# Altium project LoraWIO_module.PrjPcb
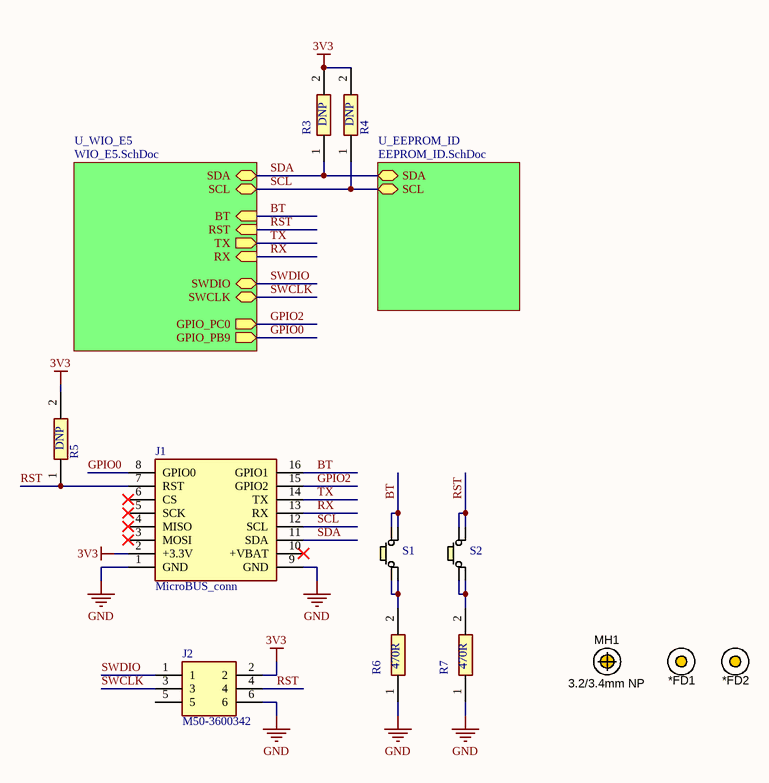
[diagram p0: main.SchDoc]
Author: Evžen Šteif; Revision: 1.0
3 sheets, 24 parts. Net scope: hierarchical (ports join the sheet entries above them; power ports are global).
Board file: LoraWio_module.PcbDoc
Sheets:
  main.SchDoc
    U_WIO_E5 = WIO_E5.SchDoc
    U_EEPROM_ID = EEPROM_ID.SchDoc

## Sheet main.SchDoc
size A4; SheetNumber: 1; SheetTotal: 3

### Parts
*FD1  FIDUCIAL  [FIDUCIAL]  (value not drawn)
*FD2  FIDUCIAL  [FIDUCIAL]  (value not drawn)
J1  MicroBUS_conn  [MicroBUS_header]
J2  M50-3600342  [HUSSP6W42P127_2X3_381X340X440P]
MH1  3.2/3.4mm NP  [TH_MH3.2/3.4NP]  (no BOM)
R3  DNP  [RESC1005X35N]
R4  DNP  [RESC1005X35N]
R5  DNP  [RESC1005X35N]
R6  470R  [RESC1005X40N]
R7  470R  [RESC1005X40N]
S1  KMR731NG_LFS  [KMR731NGLFS]  (value not drawn)
S2  KMR731NG_LFS  [KMR731NGLFS]  (value not drawn)

### Sub-sheets
U_EEPROM_ID = EEPROM_ID.SchDoc: SDA (bidir), SCL (bidir)
U_WIO_E5 = WIO_E5.SchDoc: SWDIO (bidir), SWCLK (bidir), RST (in), TX (out), RX (in), SCL (bidir), SDA (bidir), BT (in), GPIO_PC0 (out), GPIO_PB9 (out)

### Nets
3V3: J1.2(+3.3V) J2.2 R3.2 R4.2 R5.2
GND: J1.1(GND) J1.9(GND) J2.6 R6.1 R7.1
BT: J1.16(GPIO1) S1.3 S1.4 ; sheet U_WIO_E5/BT
GPIO0: J1.8(GPIO0) ; sheet U_WIO_E5/GPIO_PB9
GPIO2: J1.15(GPIO2) ; sheet U_WIO_E5/GPIO_PC0
RST: J1.7(RST) J2.4 R5.1 S2.3 S2.4 ; sheet U_WIO_E5/RST
RX: J1.13(RX) ; sheet U_WIO_E5/RX
SCL: J1.12(SCL) R4.1 ; sheet U_WIO_E5/SCL, sheet U_EEPROM_ID/SCL
SDA: J1.11(SDA) R3.1 ; sheet U_WIO_E5/SDA, sheet U_EEPROM_ID/SDA
SWCLK: J2.3 ; sheet U_WIO_E5/SWCLK
SWDIO: J2.1 ; sheet U_WIO_E5/SWDIO
TX: J1.14(TX) ; sheet U_WIO_E5/TX
NetR6_2: R6.2 S1.1 S1.2
NetR7_2: R7.2 S2.1 S2.2

Not connected (* = marked no-connect by the designer): *FD1 1; *FD2 1; J1 3(MOSI)* 4(MISO)* 5(SCK)* 6(CS)* 10(+VBAT)*; J2 5

### Notes on the sheet
- Title:
- Date:
- Project:
- Type:
- Schematic
- Variant:
- Revision:
- Sheet
- of
- Author:
- Evžen Šteif
- Size:
- A4

### Library data of the parts
*FD1 *FD2 = MCH_00028: Autor: Lukas Krahulec; Jablotron_Price: 0; Location: LE; Active: 1; Temperature_Min: -55; Temperature_Max: 125; TemperatureRange: Military; Sourcing: None; Generic_replacement: No; LatestRevisionDate: 25.6.2018; Value: Fiducial; PartNumber: MCH_00028; LE_Price: 0; Technology: NOP; Designer: Lukas Krahulec; Librarian: Lukas Krahulec; Manufacturer: LE; FIT: 0; ComponentLink1URL: http://www.logicelements.cz; ComponentLink1Description: Manufacturer Web; Cat1: Fiducial; ROHS: 1; Storage_Count: 0
J1 = MicroBUS_conn: Connector; Manufacturer_Name: Harwin; Manufacturer_Part_Number: M20-9730845; Datasheet Link: https://cdn.harwin.com/pdfs/M20-973.pdf; Height: 9.54mm; Mouser Part Number: 855-M20-9730845; Mouser Price/Stock: https://www.mouser.co.uk/ProductDetail/Harwin/M20-9730845?qs=%252Bk6%2F5FB6qrnRfgIEPS4Dkw%3D%3D
J2 = M50-3600342: Connector; Manufacturer_Name: Harwin; Datasheet Link: https://cdn.harwin.com/pdfs/M50-360.pdf; Manufacturer_Part_Number: M50-3600342; Mouser Part Number: 855-M50-3600342; Mouser Price/Stock: https://www.mouser.co.uk/ProductDetail/Harwin/M50-3600342?qs=uLfVlVfCHH3O1msIjvLxbQ%3D%3D
MH1 = MCH_00037: (Mount Hole 3.2mm); Autor: Lukas Krahulec; Jablotron_Price: 0; Location: LE; Active: 1; Temperature_Min: -55; Temperature_Max: 125; TemperatureRange: Military; Cat1: Mounting Holes; Cat2: Non-Plated; Sourcing: None; Generic_replacement: No; LatestRevisionDate: 24.2.2020; Value: 3.2/3.4mm NP; PartNumber: MCH_00037; LE_Price: 0; Technology: NOP; Designer: Lukas Krahulec; Librarian: Lukas Krahulec; Manufacturer: LE; FIT: 0; ComponentLink1URL: http://www.logicelements.cz; ComponentLink1Description: Manufacturer Web; Cat3: 3.2 mm; ROHS: 1; Storage_Count: 0
R3-R5 = RT0402FRE075K1L: Resistor; Manufacturer_Name: YAGEO; Datasheet Link: https://www.yageo.com/upload/media/product/app/datasheet/rchip/pyu-rt_1-to-0.01_rohs_l.pdf; Height: 0.35mm; Manufacturer_Part_Number: RT0402FRE075K1L; Mouser Part Number: RT0402FRE075K1L; Mouser Price/Stock: https://www.mouser.co.uk/ProductDetail/YAGEO/RT0402FRE07100RL?qs=BXCcY9r%252B08AcvLZjF7vcwQ%3D%3D
R6 R7 = RC0402JR-07470RL: Resistor; Manufacturer_Name: KEMET; Datasheet Link: http://www.yageo.com/documents/recent/PYu-RC0402_51_RoHS_L_6_r.pdf; Height: 0.4mm; Manufacturer_Part_Number: RC0402JR-07470RL; Mouser Part Number: 603-RC0402JR-07470RL; Mouser Price/Stock: https://www.mouser.co.uk/ProductDetail/Yageo/RC0402JR-07470RL/?qs=uM1JSSdPjOBB2HN7BZcUiA%3D%3D; Arrow Part Number: RC0402JR-07470RL; Arrow Price/Stock: https://www.arrow.com/en/products/rc0402jr-07470rl/yageo
S1 S2 = KMR731NG_LFS: Switch; Manufacturer_Name: C & K COMPONENTS; Manufacturer_Part_Number: KMR731NG LFS; Datasheet Link: https://www.ckswitches.com/media/1908/kmr7.pdf; Mouser Part Number: 611-KMR731NGLFS; Mouser Price/Stock: https://www.mouser.com/Search/Refine.aspx?Keyword=611-KMR731NGLFS; Arrow Part Number: KMR731NG LFS; Arrow Price/Stock: https://www.arrow.com/en/products/kmr731nglfs/ck

## Sheet WIO_E5.SchDoc
size A4; SheetNumber: 2; SheetTotal: 3
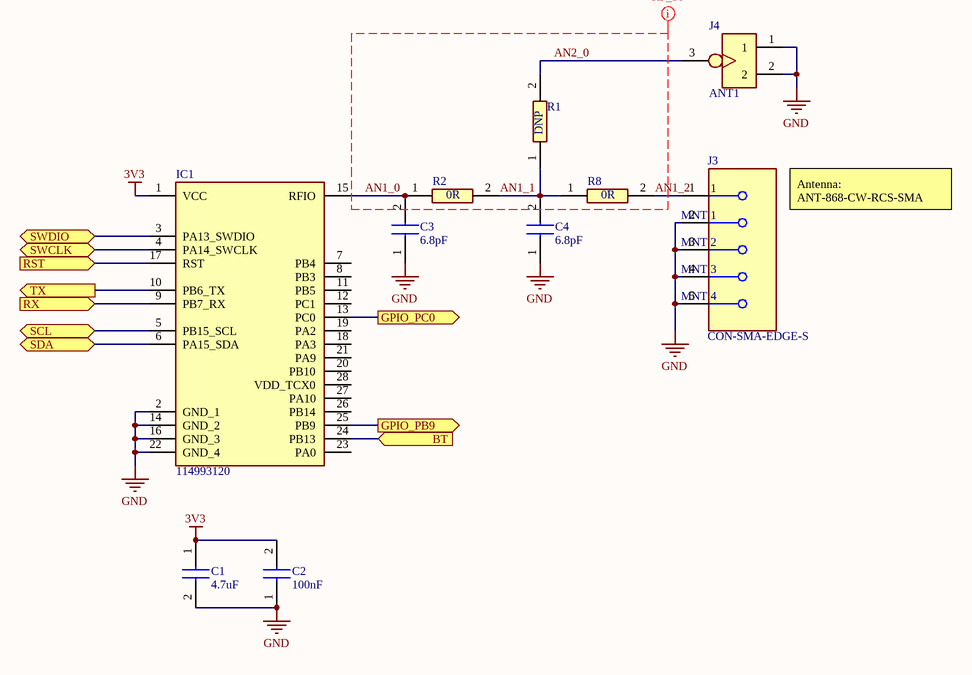
[diagram p1: WIO_E5.SchDoc]

### Parts
C1  4.7uF  [CAPC1608X90N]
C2  100nF  [CAPC1005X70N]
C3  6.8pF  [GCM155]
C4  6.8pF  [GCM155]
IC1  114993120  [114993120]
J3  CON-SMA-EDGE-S  [FP-CON-SMA-EDGE-S-MFG]
J4  ANT1  [RECE.20279.001E.01]
R1  DNP  [RESC1005X40N]
R2  0R  [RESC1005X40N]
R8  0R  [RESC1005X40N]

### Ports
BT (in, see main[2B]), GPIO_PB9 (out, see main[2B]), GPIO_PC0 (out, see main[2B]), RST (in, see main[2B]), RX (in, see main[2B]), SCL (bidir, see main[2B], EEPROM_ID[3B]), SDA (bidir, see main[2B], EEPROM_ID[3B]), SWCLK (bidir, see main[2B]), SWDIO (bidir, see main[2B]), TX (out, see main[2B])

### Nets
3V3: C1.1 C2.2 IC1.1(VCC)
GND: C1.2 C2.1 C3.1 C4.1 IC1.2(GND_1) IC1.14(GND_2) IC1.16(GND_3) IC1.22(GND_4) J3.2(MNT_1) J3.3(MNT_2) J3.4(MNT_3) J3.5(MNT_4) J4.1 J4.2
AN1_0: C3.2 IC1.15(RFIO) R2.1
AN1_1: C4.2 R1.1 R2.2 R8.1
AN1_2: J3.1 R8.2
AN2_0: J4.3 R1.2
BT: IC1.24(PB13) ; port BT
GPIO0: IC1.25(PB9) ; port GPIO_PB9
GPIO2: IC1.13(PC0) ; port GPIO_PC0
RST: IC1.17(RST) ; port RST
RX: IC1.9(PB7_RX) ; port RX
SCL: IC1.5(PB15_SCL) ; port SCL
SDA: IC1.6(PA15_SDA) ; port SDA
SWCLK: IC1.4(PA14_SWCLK) ; port SWCLK
SWDIO: IC1.3(PA13_SWDIO) ; port SWDIO
TX: IC1.10(PB6_TX) ; port TX

Not connected (* = marked no-connect by the designer): IC1 7(PB4) 8(PB3) 11(PB5) 12(PC1) 18(PA3) 19(PA2) 20(PB10) 21(PA9) 23(PA0) 26(PB14) 27(PA10) 28(VDD_TCX0)

### Layout directives
net class RF_50: AN1_0, AN1_1, AN1_2, AN2_0

### Notes on the sheet
- Antenna:
  ANT-868-CW-RCS-SMA
- Title:
- Date:
- Project:
- Type:
- Schematic
- Variant:
- Revision:
- Sheet
- of
- Author:
- Evžen Šteif
- Size:
- A4

### Library data of the parts
C1 = GRM188R61E475KE11J: Capacitor; Manufacturer_Name: Murata Electronics; Datasheet Link: https://search.murata.co.jp/Ceramy/image/img/A01X/G101/ENG/GRM188R61E475KE11-01A.pdf; Height: 0.9mm; Manufacturer_Part_Number: GRM188R61E475KE11J; Mouser Part Number: 81-GRM188R61E475KE1J; Mouser Price/Stock: https://www.mouser.co.uk/ProductDetail/Murata-Electronics/GRM188R61E475KE11J?qs=hNud%2FORuBR3%2Fa9GLJFT8KA%3D%3D; Arrow Part Number: GRM188R61E475KE11J; Arrow Price/Stock: https://www.arrow.com/en/products/grm188r61e475ke11j/murata-manufacturing
C2 = GRM155R61A104KA01D: Capacitor; Manufacturer_Name: Murata Electronics; Datasheet Link: https://search.murata.co.jp/Ceramy/image/img/A01X/G101/ENG/GRM155R61A104KA01-02A.pdf; Height: 0.7mm; Manufacturer_Part_Number: GRM155R61A104KA01D; Mouser Part Number: 81-GRM155R61A104KA01; Mouser Price/Stock: https://www.mouser.co.uk/ProductDetail/Murata-Electronics/GRM155R61A104KA01D?qs=5bAuhL3RhmNZw0v59AqOJA%3D%3D; Arrow Part Number: GRM155R61A104KA01D; Arrow Price/Stock: https://www.arrow.com/en/products/grm155r61a104ka01d/murata-manufacturing?utm_currency=USD&region=europe
C3 C4 = GCM1555C1H6R8BA16J: Capacitor; Manufacturer_Name: Murata Electronics; Datasheet Link: https://search.murata.co.jp/Ceramy/image/img/A01X/G101/ENG/GCM1555C1H6R8BA16-01A.pdf; Height: 0.55mm; Manufacturer_Part_Number: GCM1555C1H6R8BA16J; Mouser Part Number: 81-GCM1555C1H6R8BA6J; Mouser Price/Stock: https://www.mouser.co.uk/ProductDetail/Murata-Electronics/GCM1555C1H6R8BA16J?qs=QzBtWTOodeUHvskaC%252BV70A%3D%3D
IC1 = 114993120: Integrated Circuit; Manufacturer_Name: Seeed Studio; Datasheet Link: https://files.seeedstudio.com/products/114993120/Wio-E5-LE%20module%20datasheet_v1.0.pdf; Height: 2.7mm; Manufacturer_Part_Number: 114993120; Mouser Part Number: 713-114993120; Mouser Price/Stock: https://www.mouser.co.uk/ProductDetail/Seeed-Studio/114993120?qs=QpmGXVUTftHkewPVPDVW5g%3D%3D; Arrow Part Number: 114993120; Arrow Price/Stock: https://www.arrow.com/en/products/114993120/seeed-technology-limited?utm_currency=USD&region=nac
J3 = CMP-204357-000001-1: CONN SMA JACK STR EDGE MNT; Manufacturer: RF Solutions Ltd.; Impedance: 50Ω; Conn Orientation: Right Angle; Is Female: yes; Number Of Contacts: 1; Frequency: 18GHz; Shielding: true; Category: Conn; ComponentLink2URL: https://www.rfsolutions.co.uk/downloads/1498648656DS-CON-EDGE-SMA-4.pdf; Octopart: https://octopart.com/con-sma-edge-s-rf+solutions-70967450; Package: CONN_JACK; Manufacturer Part Number: CON-SMA-EDGE-S; Height: 6.35mm; Device Class L1: Connectors; Footprint Url: https://forum.upverter.com/uploads/default/original/3X/b/e/be75b907af57498775929d6d9099689c472e0307.pdf; Contact Material: Gold; ComponentLink2Description: Datasheet; Device Class L2: RF / Coaxial Connectors; RoHS: TRUE; Device Class L3: unset; Digikey Description: CONN SMA JACK STR EDGE MNT; Lead Free: Yes; Automotive: No
J4 = RECE-20279-001E-01: Connector; Manufacturer_Name: Taoglas; Manufacturer_Part_Number: RECE-20279-001E-01; Mouser Part Number: N/A; Mouser Price/Stock: https://www.mouser.co.uk/ProductDetail/Taoglas/RECE-20279-001E-01?qs=WUa1z%2FNV9%252B3mVij1vDlP0A%3D%3D
R1 R2 R8 = RCA04020000ZSED: Resistor; Manufacturer_Name: Vishay; Datasheet Link: https://componentsearchengine.com/Datasheets/2/RCA04020000ZSED.pdf; Height: 0.4mm; Manufacturer_Part_Number: RCA04020000ZSED; Mouser Part Number: 71-RCA04020000ZSED; Mouser Price/Stock: https://www.mouser.co.uk/ProductDetail/Vishay-Draloric/RCA04020000ZSED?qs=gk21WLQFtgRTmhk63km%2F1w%3D%3D; Arrow Part Number: RCA04020000ZSED; Arrow Price/Stock: https://www.arrow.com/en/products/rca04020000zsed/vishay?utm_currency=USD&region=nac

## Sheet EEPROM_ID.SchDoc
size A4; SheetNumber: 3; SheetTotal: 3
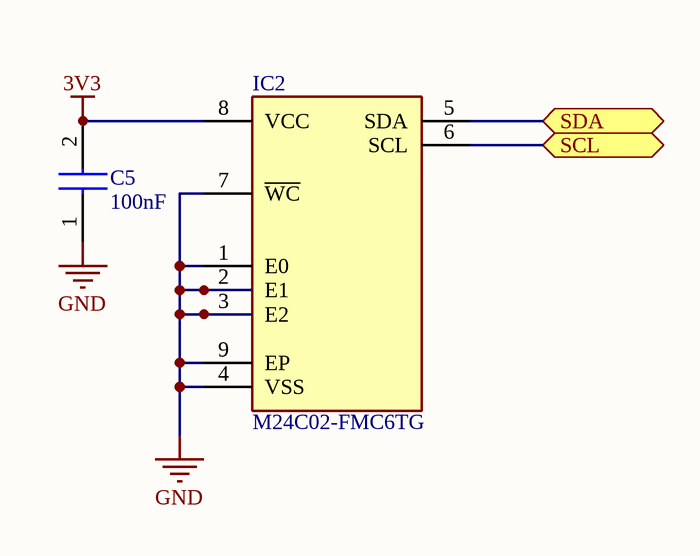
[diagram p2: EEPROM_ID.SchDoc]

### Parts
C5  100nF  [CAPC1005X70N]
IC2  M24C02-FMC6TG  [M24C02FMC6TG]

### Ports
SCL (bidir, see main[2B], WIO_E5[1C]), SDA (bidir, see main[2B], WIO_E5[1C])

### Nets
3V3: C5.2 IC2.8(VCC)
GND: C5.1 IC2.1(E0) IC2.2(E1) IC2.3(E2) IC2.4(VSS) IC2.7(~{WC}) IC2.9(EP)
SCL: IC2.6(SCL) ; port SCL
SDA: IC2.5(SDA) ; port SDA

### Notes on the sheet
- Title:
- Date:
- Project:
- Type:
- Schematic
- Variant:
- Revision:
- Sheet
- of
- Author:
- Evžen Šteif
- Size:
- A4

### Library data of the parts
C5 = GRM155R61A104KA01D: as C2 on sheet WIO_E5; Datasheet Link: https://search.murata.co.jp/Ceramy/image/img/A01X/G101/ENG/GRM155R61A104KA01-02A.pdf; Height: 0.7mm; Manufacturer_Part_Number: GRM155R61A104KA01D; Mouser Part Number: 81-GRM155R61A104KA01; Mouser Price/Stock: https://www.mouser.co.uk/ProductDetail/Murata-Electronics/GRM155R61A104KA01D?qs=5bAuhL3RhmNZw0v59AqOJA%3D%3D; Arrow Part Number: GRM155R61A104KA01D; Arrow Price/Stock: https://www.arrow.com/en/products/grm155r61a104ka01d/murata-manufacturing?utm_currency=USD&region=europe
IC2 = M24C02-FMC6TG: Integrated Circuit; Manufacturer_Name: STMicroelectronics; Datasheet Link: https://www.st.com/resource/en/datasheet/m24c01-r.pdf; Height: 0.6mm; Manufacturer_Part_Number: M24C02-FMC6TG; Mouser Part Number: 511-M24C02-FMC6TG; Mouser Price/Stock: https://www.mouser.co.uk/ProductDetail/STMicroelectronics/M24C02-FMC6TG?qs=WHlX%252B%252B9%2FRwB%252BxJ8bQxWbzQ%3D%3D; Arrow Part Number: M24C02-FMC6TG; Arrow Price/Stock: https://www.arrow.com/en/products/m24c02-fmc6tg/stmicroelectronics?region=nac

## Nets that join several sheets
3V3: main (5 pins), WIO_E5 (C1.1 C2.2 IC1.1), EEPROM_ID (C5.2 IC2.8)
GND: main (5 pins), WIO_E5 (14 pins), EEPROM_ID (7 pins)
BT: main (J1.16 S1.3 S1.4), WIO_E5 (IC1.24)
GPIO0: main (J1.8), WIO_E5 (IC1.25)
GPIO2: main (J1.15), WIO_E5 (IC1.13)
RST: main (5 pins), WIO_E5 (IC1.17)
RX: main (J1.13), WIO_E5 (IC1.9)
SCL: main (J1.12 R4.1), WIO_E5 (IC1.5), EEPROM_ID (IC2.6)
SDA: main (J1.11 R3.1), WIO_E5 (IC1.6), EEPROM_ID (IC2.5)
SWCLK: main (J2.3), WIO_E5 (IC1.4)
SWDIO: main (J2.1), WIO_E5 (IC1.3)
TX: main (J1.14), WIO_E5 (IC1.10)

## Assembly variants
LoraWio_module_assembly: not fitted C3 C3 C3 C4 C4 C4 C? C? IC? J2 J2 R1 R1 R3 R3 R4 R5 R? R? R? R?